# Altium project PCB_Микропроцессор.PrjPcb
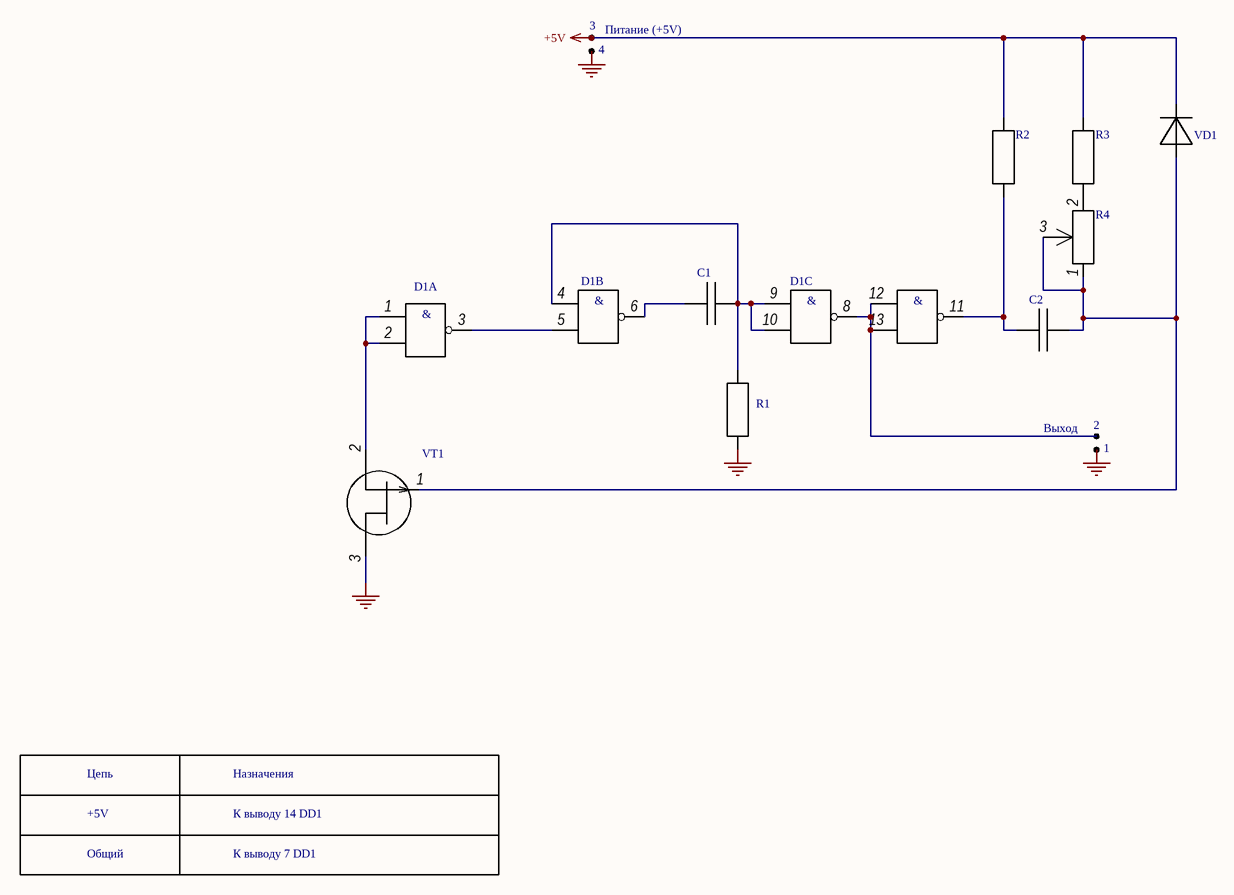
[diagram p0: Schema.SchDoc]
1 sheet, 13 parts. Net scope: global (net labels, ports and power ports of the same name join across sheets).

## Sheet Schema.SchDoc
size 420 x 297 mm; ApprovedBy: Иванов В.И.; CheckedBy: Кудинов С.И.; Author: Ахтаров Д.Н.; CompanyName: УрФУ, каф ТСС; DocumentNumber: АРВЦ.468784 .001 ПЭ3; SheetNumber: 1; SheetTotal: 1; PageSetup: Record=PageOptions|CenterHorizontal=False|CenterVertical=False|PrintScale=0.95|XCorrection=0.00|YCorrection=0.00|PrintKind=1|BorderSize=5000000|LeftOffset=0|BottomOffset=0|Orientation=1|PaperLength=1000|PaperWidth=1000|Scale=100|PaperSource=15|PrintQuality=600|MediaType=1|DitherType=10|PaperKind=A4|PrintScaleMode=1; ProcessInspection: Плохих О.В.; EngineerName: {Инженер}; Letter1Column: {}; Letter2Column: {}; Letter3Column: {}; DocumentType: {Документ}; DocumentType1str: {Документ}; DocumentType2str: {Документ}; Title2: Задающий генератор; Title3: с постоянной длительностью импульса; Title5: Схема электрическая принципиальная

### Parts
1  Point  [Point]  (value not drawn)
2  2  [Point]
3  Point  [Point]  (value not drawn)
4  Point  [Point]  (value not drawn)
C1  С постоянный  [B37986-N]  (value not drawn)
C2  С постоянный  [B37986-N]  (value not drawn)
D1  (no value)  [К155ЛА3]  (parts A,B,C,D of 4)
R1  R_0.125_10  [R_ 0,125_10]  (value not drawn)
R2  R_0,125_10  [R_ 0,125_10]  (value not drawn)
R3  R_0,125_10  [R_ 0,125_10]  (value not drawn)
R4  R регулируемый  [R рег_BOURNS3296-3/8]  (value not drawn)
VD1  D  [D9A]  (value not drawn)
VT1  Tранзистор полевой с каналом P-типа  [SOT223]  (value not drawn)

### Nets
GND: 1.1 4.1 D1.7(GND) R1.1 VT1.3
Питание (+5V): 3.1 D1.14(+5V) R2.2 R3.2 VD1.2  [also labelled +5V]
Выход: 2.1 D1.8 D1.12 D1.13
NetC1_1: C1.1 D1.6
NetC1_2: C1.2 D1.4 D1.9 D1.10 R1.2
NetC2_1: C2.1 D1.11 R2.1
NetC2_2: C2.2 R4.1 R4.3 VD1.1 VT1.1
NetD1_1: D1.1 D1.2 VT1.2
NetD1_3: D1.3 D1.5
NetR3_1: R3.1 R4.2

### Notes on the sheet
- Цепь
- +5V
- Назначения
- К выводу 14 DD1
- Общий
- К выводу 7 DD1
- Перв примен.
- Справ. №
- Подп. и дата
- Инв. № дубл.
- Инв. № подл.
- Изм.
- Лист.
- № докум.
- Подп.
- Дата
- Лит.
- Масса
- Масштаб
- Разраб
- Пров.
- Т. контр
- Лист
- Листов
- Н. контр
- Утв.
- Копировал
- Формат А3
- (in symbol К155ЛА3_ПМ, part A) &
- (in symbol К155ЛА3_ПМ, part B) &
- (in symbol К155ЛА3_ПМ, part C) &
- (in symbol К155ЛА3_ПМ, part D) &

### Library data of the parts
2 = Point
D1 = К155ЛА3_ПМ